# Altium schematic sheet LPCOExtended.SchDoc
size B; SheetNumber: 1; SheetTotal: 1
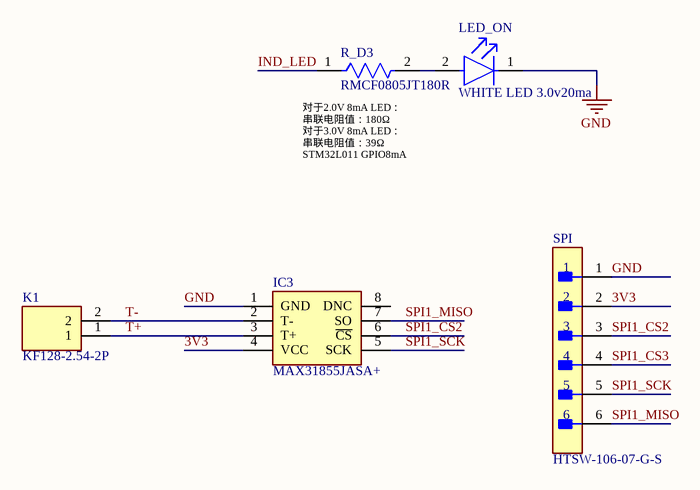
[diagram p0: LPCOExtended.SchDoc]

## Parts
IC3  MAX31855JASA+  [SOIC127P600X175-8N]
K1  KF128-2.54-2P  [KF1282542P]
LED_ON  WHITE LED 3.0v20ma  [FP-SML-LX0805UWC-TR-MFG]
R_D3  RMCF0805JT180R  [FP-RMCF0805-IPC_B]
SPI  HTSW-106-07-G-S  [FP-HTSW-106-07-G-S-MFG]

## Nets
GND: IC3.1(GND) LED_ON.1(C) SPI.1
3V3: IC3.4(VCC) SPI.2
IND_LED: R_D3.1
SPI1_CS2: IC3.6(~{CS}) SPI.3
SPI1_CS3: SPI.4
SPI1_MISO: IC3.7(SO) SPI.6
SPI1_SCK: IC3.5(SCK) SPI.5
T+: IC3.3(T+) K1.1
T-: IC3.2(T-) K1.2
NetLED_ON_2: LED_ON.2(A) R_D3.2

Not connected (* = marked no-connect by the designer): IC3 8(DNC)

## Notes on the sheet
- 对于2.0V 8mA LED：
  串联电阻值：180Ω
  对于3.0V 8mA LED：
  串联电阻值：39Ω
  STM32L011 GPIO8mA

## Library data of the parts
IC3 = MAX31855JASA+: Integrated Circuit; Manufacturer_Name: Analog Devices; Datasheet Link: https://datasheets.maximintegrated.com/en/ds/MAX31855.pdf; Height: 1.75mm; Manufacturer_Part_Number: MAX31855JASA+; Mouser Part Number: 700-MAX31855JASA+; Mouser Price/Stock: https://www.mouser.co.uk/ProductDetail/Analog-Devices-Maxim-Integrated/MAX31855JASA%2b?qs=4Rc5iGDDRGgfomCSqMwnEw%3D%3D; Arrow Part Number: MAX31855JASA+; Arrow Price/Stock: https://www.arrow.com/en/products/max31855jasa/analog-devices?utm_currency=USD&region=nac
K1 = KF128-2.54-2P: Connector; Manufacturer_Name: CIXI KEFA ELECTRONICS; Datasheet Link: https://jirorwxhqiillo5p.ldycdn.com/KF128-2.54-aidqpBpqKirRliSqmrqirlki.pdf; Height: 9.1mm; Manufacturer_Part_Number: KF128-2.54-2P
LED_ON = CMP-00229-00139794-1: SML-LX0805UWC-TR White LED, 0805 Diffused, Rectangle Lens SMD package; NexarPartId: 139794; Approvals: CSA, UL; Lens Color: Clear, Yellow; Luminous Intensity: 150mcd; Power Rating: 120mW; Forward Current: 20mA; Forward Voltage: 3.5V; Number of LEDs: 1; Viewing Angle: 120°; RoHS: Compliant; Case/Package: 0805; Illumination Color: White; Min Operating Temperature: -40°C; Mount: Surface Mount; Max Operating Temperature: 85°C
R_D3 = CMP-26527-003283-1: 180Ω ±5% 0.125W 0805 Thick Film Chip Resistor AEC-Q200 compliant; Max Power Dissipation: 125mW; Temperature Coefficient: 200ppm/°C; Resistance: 180R; Case Code (Imperial): 0805; Height: 0.026inch; Case Code (Metric): 2012; Length: 0.079inch; Series: RMCF; Lead Free: Lead Free; Number of Terminations: 2; Military Standard: Not; Packaging: Tape and Reel; Case/Package: 0805; Mount: Surface Mount; Resistor Type: Thick Film; Radiation Hardening: No; Features: Automotive AEC-Q200; Construction: Rectangular; Tolerance: 5%; Contact Plating: Tin; RoHS Compliant: Yes; Min Operating Temperature: -55°C; Depth: 1.25mm; Max Operating Temperature: 155°C; Width: 0.049inch
SPI = CMP-02766-001515-1: CONN HEADER VERT 6POS 2.54MM; Number of Positions: 6; Pitch: 0.1inch; Max Voltage Rating (AC): 550V; Gender: Male; Max Current Rating: 7.6A; Contact Type: Male Pin; Contact Finish - Mating: GOLD; REACH SVHC: No SVHC; Number of Rows: 1; Insulation Material: Polymer; Housing Color: Natural; Connector Type: Header; Termination: Solder; Flammability Rating: UL94 V-0; Mount: Through Hole; Contact Shape: Square; Fastening Type: Pull; Max Operating Temperature: 125°C; Contact Material: Bronze; RoHS Compliant: Yes; Series: HTSW; Min Operating Temperature: -55°C; Contact Mating Length: 0.23inch; Orientation: Straight; Number of Contacts: 6; Depth: 2.48mm; Housing Material: Polymer; Insulation Color: Natural; Lead Free: Lead Free; Radiation Hardening: No; Length: 15.24mm; Contact Plating: Gold; Color: Natural; Packaging: Rail/Tube